# EAGLE design MoteinoM0_mic_v0.4 (EAGLE 9.6.2)
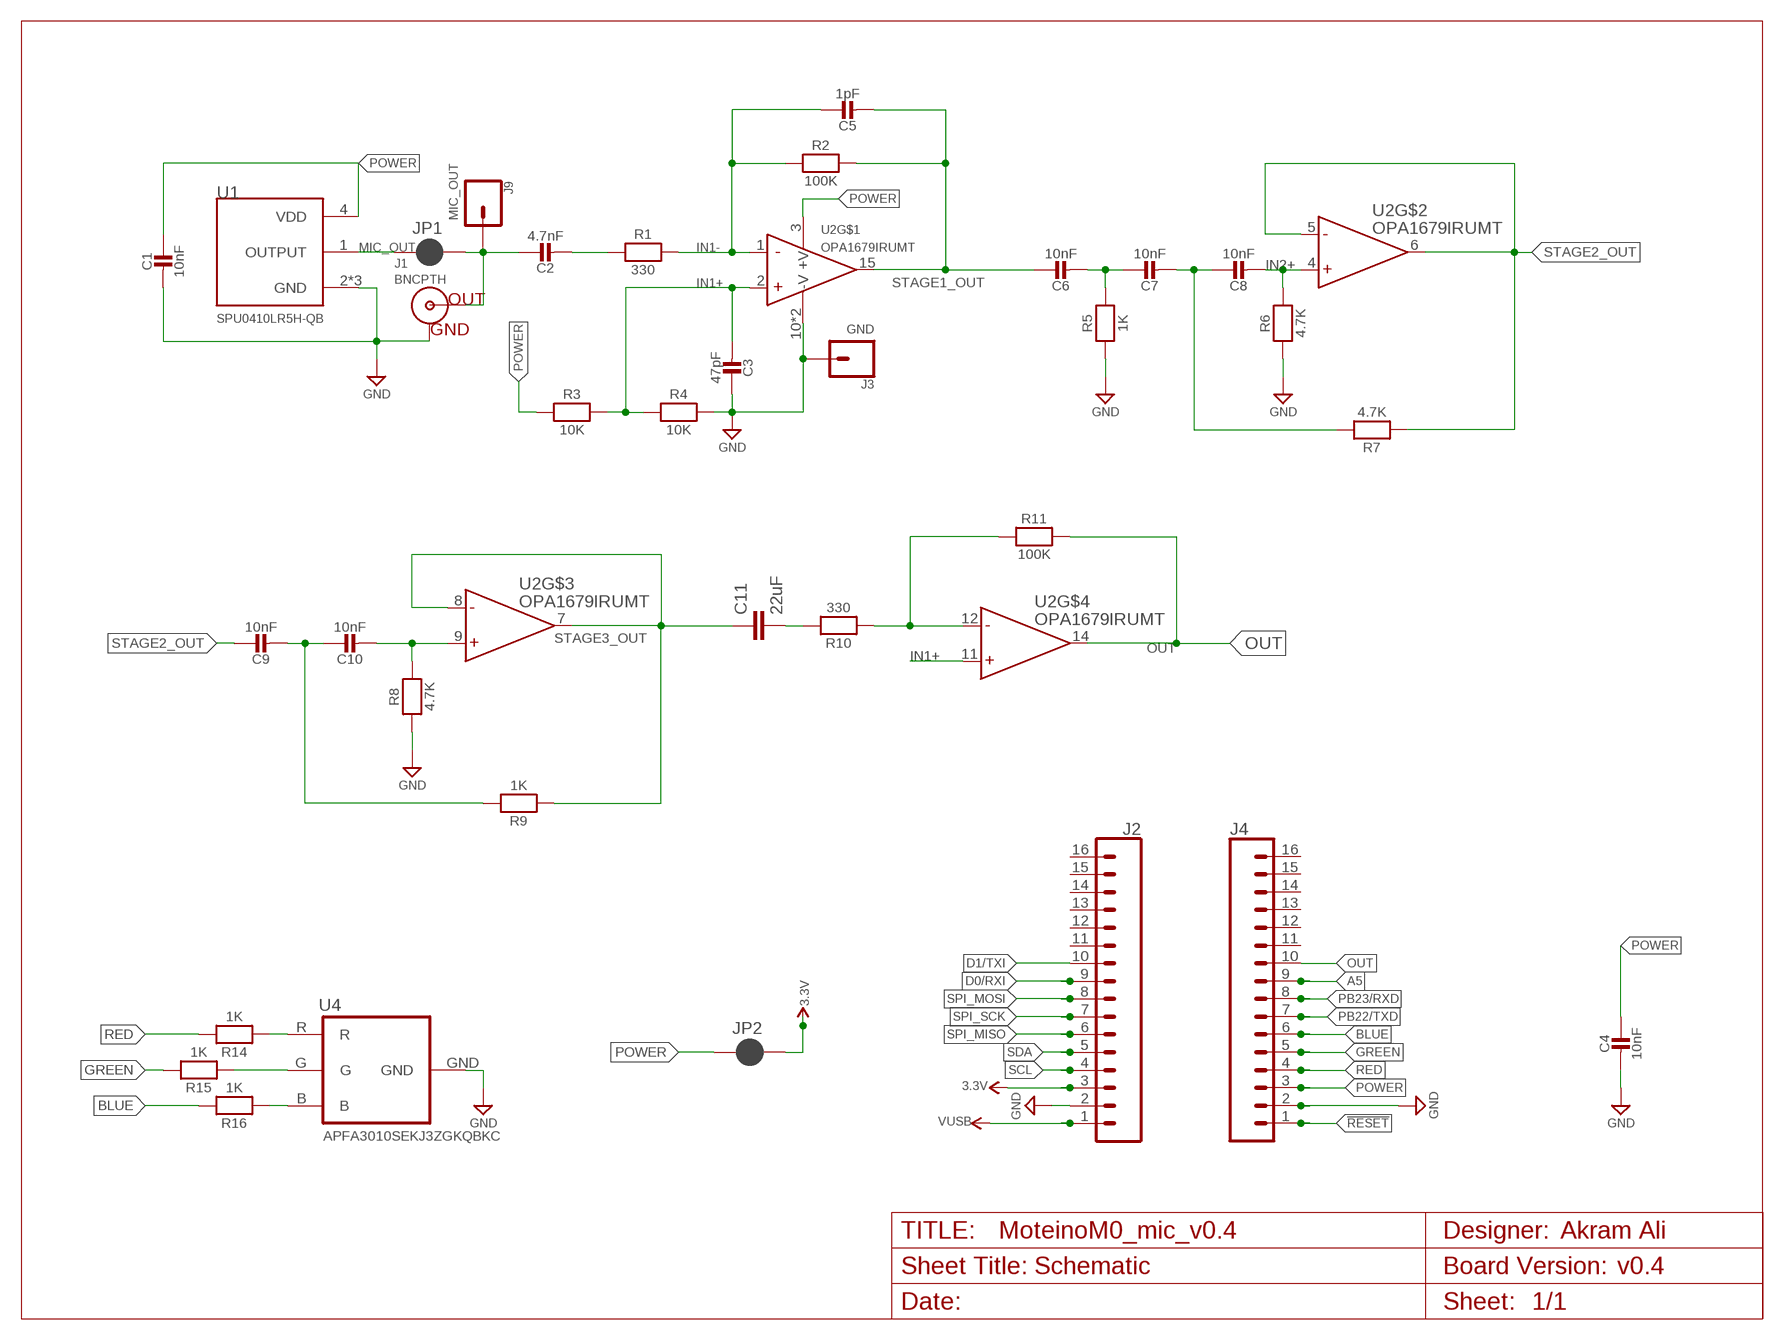
[diagram p0: schematic, sheet 1]

## Parts
C1  10nF  MICROBUILDER_CAP_CERAMIC_0402MP  [MICROBUILDER__0402MP]
C2  4.7nF  MICROBUILDER_CAP_CERAMIC_0402MP  [MICROBUILDER__0402MP]
C3  47pF  MICROBUILDER_CAP_CERAMIC_0402MP  [MICROBUILDER__0402MP]
C4  10nF  MICROBUILDER_CAP_CERAMIC_0402MP  [MICROBUILDER__0402MP]
C5  1pF  MICROBUILDER_CAP_CERAMIC_0402MP  [MICROBUILDER__0402MP]
C6  10nF  MICROBUILDER_CAP_CERAMIC_0402MP  [MICROBUILDER__0402MP]
C7  10nF  MICROBUILDER_CAP_CERAMIC_0402MP  [MICROBUILDER__0402MP]
C8  10nF  MICROBUILDER_CAP_CERAMIC_0402MP  [MICROBUILDER__0402MP]
C9  10nF  MICROBUILDER_CAP_CERAMIC_0402MP  [MICROBUILDER__0402MP]
C10  10nF  MICROBUILDER_CAP_CERAMIC_0402MP  [MICROBUILDER__0402MP]
C11  22uF  CAP0805  [0805]
J1  BNCPTH  [BNC]
J2  CONN_161X16_NO_SILK  [1X16_NO_SILK]
J3  GND  CONN_01  [1X01]
J4  CONN_161X16_NO_SILK  [1X16_NO_SILK]
J9  MIC_OUT  CONN_01  [1X01]
JP1  JUMPER-SMT_2_NC_PASTE_SILK  [SMT-JUMPER_2_NC_PASTE_SILK]
JP2  JUMPER-SMT_2_NC_PASTE_SILK  [SMT-JUMPER_2_NC_PASTE_SILK]
R1  330  MICROBUILDER_RESISTOR_0402MP  [MICROBUILDER__0402MP]
R2  100K  MICROBUILDER_RESISTOR_0402MP  [MICROBUILDER__0402MP]
R3  10K  MICROBUILDER_RESISTOR_0402MP  [MICROBUILDER__0402MP]
R4  10K  MICROBUILDER_RESISTOR_0402MP  [MICROBUILDER__0402MP]
R5  1K  MICROBUILDER_RESISTOR_0402MP  [MICROBUILDER__0402MP]
R6  4.7K  MICROBUILDER_RESISTOR_0402MP  [MICROBUILDER__0402MP]
R7  4.7K  MICROBUILDER_RESISTOR_0402MP  [MICROBUILDER__0402MP]
R8  4.7K  MICROBUILDER_RESISTOR_0402MP  [MICROBUILDER__0402MP]
R9  1K  MICROBUILDER_RESISTOR_0402MP  [MICROBUILDER__0402MP]
R10  330  MICROBUILDER_RESISTOR_0402MP  [MICROBUILDER__0402MP]
R11  100K  MICROBUILDER_RESISTOR_0402MP  [MICROBUILDER__0402MP]
R14  1K  MICROBUILDER_RESISTOR_0402MP  [MICROBUILDER__0402MP]
R15  1K  MICROBUILDER_RESISTOR_0402MP  [MICROBUILDER__0402MP]
R16  1K  MICROBUILDER_RESISTOR_0402MP  [MICROBUILDER__0402MP]
U1  SPU0410LR5H-QB  [XDCR_SPU0410LR5H-QB]
U2  OPA1679IRUMT  [QFN65P400X400X80-17N]
U4  APFA3010SEKJ3ZGKQBKC  [SMD-RA-4]

## Nets
3.3V: J2.3 JP2.2
!RESET: J4.1
A5: J4.9
BLUE: J4.6 R16.2
D0/RXI: J2.9
D1/TXI: J2.10
GND: C1.2 C3.1 C4.2 J1.GND J2.2 J3.1 J4.2 R4.2 R5.1 R6.1 R8.1 U1.2(GND) U1.3(GND) U1.5(GND) U2.10(-V) U2.17(-V) U4.GND
GREEN: J4.5 R15.2
IN1+: C3.2 R3.2 R4.1 U2.2(+IN) U2.11(+IN)
IN1-: C5.1 R1.2 R2.1 U2.1(-IN)
IN2+: C8.2 R6.2 U2.4(+IN)
MIC_OUT: C2.1 J1.S(OUT) J9.1 JP1.2
N$1: C9.2 C10.1 R9.2
N$2: C6.2 C7.1 R5.2
N$3: C7.2 C8.1 R7.2
N$4: C2.2 R1.1
N$6: R14.1 U4.R
N$7: C10.2 R8.2 U2.9(+IN)
N$8: C11.2 R10.2
N$10: R15.1 U4.G
N$11: R10.1 R11.1 U2.12(-IN)
N$15: R16.1 U4.B
N$19: JP1.1 U1.1(OUTPUT)
OUT: J4.10 R11.2 U2.14(OUT)
PB22/TXD: J4.7
PB23/RXD: J4.8
POWER: C1.1 C4.1 J4.3 JP2.1 R3.1 U1.4(VDD) U2.3(+V)
RED: J4.4 R14.2
SCL: J2.4
SDA: J2.5
SPI_MISO: J2.6
SPI_MOSI: J2.8
SPI_SCK: J2.7
STAGE1_OUT: C5.2 C6.1 R2.2 U2.15(OUT)
STAGE2_OUT: C9.1 R7.1 U2.5(-IN) U2.6(OUT)
STAGE3_OUT: C11.1 R9.1 U2.7(OUT) U2.8(-IN)
VUSB: J2.1
Unconnected: J2.11 J2.12 J2.13 J2.14 J2.15 J2.16 J4.11 J4.12 J4.13 J4.14 J4.15 J4.16

## Notes on the sheet
- Akram Ali
- v0.4

## Library data of the parts
C1-C10 = Adafruit Feather 32u4 Bluefruit LE:MICROBUILDER_CAP_CERAMIC: Ceramic Capacitors For new designs, use the packages preceded by an '_' character since they are more reliable: The following footprints should be used on most boards: _0402 - Standard footprint for regular board layouts _0603 - Standard footprint for regular board layouts _0805 - Standard footprint for regular board layouts _1206 - Standard footprint for regular board layouts For extremely tight-pitch boards where space is at a premium, the following 'micro-pitch' footprints can be used (smaller pads, no silkscreen outline, etc.): _0402MP - Micro-pitch footprint for very dense/compact boards _0603MP - Micro-pitch footprint for very dense/compact boards _0805MP - Micro-pitch footprint for very dense/compact boards _1206MP - Micro-pitch footprint for very dense/compact boards; MPN: GRM155R71H104KE14J
C11 = SparkFun-Passives:CAP: Capacitor Standard 0603 ceramic capacitor, and 0.1" leaded capacitor.
J1 = SparkFun-Connectors:BNC: BNC Right Angle Connector Mouser Part# 5227161 SparkFun Products: BNC Connector - Right Angle <https://www.sparkfun.com/products/10550>; PROD_ID: LPA-12729; SF_ID: PRT-10550
J2 J4 = SparkFun-Connectors:CONN_16: Multi connection point. Often used as Generic Header-pin footprint for 0.1 inch spaced/style header connections On any of the 0.1 inch spaced packages, you can populate with these: Break Away Headers - Straight <https://www.sparkfun.com/products/116> (PRT-00116) Break Away Male Headers - Right Angle <https://www.sparkfun.com/products/553> (PRT-00553) Female Headers <https://www.sparkfun.com/products/115> (PRT-00115) Break Away Headers - Machine Pin <https://www.sparkfun.com/products/117> (PRT-00117) Break Away Female Headers - Swiss Machine Pin <https://www.sparkfun.com/products/743> (PRT-00743) For SCREWTERMINALS and SPRING TERMINALS visit here: Screw Terimnals on SparkFun.com <https://www.sparkfun.com/search/results?term=Screw+Terminals> (5mm/3.5mm/2.54mm spacing) This device is also useful as a general connection point to wire up your design to another part of your project. Our various solder wires solder well into these plated through hole pads. Hook-Up Wire - Assortment (Stranded, 22 AWG) <https://www.sparkfun.com/products/11375> (PRT-11375) Hook-Up Wire - Assortment (Solid Core, 22 AWG) <https://www.sparkfun.com/products/11367> (PRT-11367) View the entire wire category on our website here <https://www.sparkfun.com/categories/141> Special notes: Molex polarized connector foot print use with SKU : PRT-08231 with associated crimp pins and housings. 1MM SMD Version SKU: PRT-10208 NOTES ON THE VARIANTS LOCK and LOCK_LONGPADS... This footprint was designed to help hold the alignment of a through-hole component (i.e. 6-pin header) while soldering it into place. You may notice that each hole has been shifted either up or down by 0.005 of an inch from it's more standard position (which is a perfectly straight line). This slight alteration caused the pins (the squares in the middle) to touch the edges of the holes. Because they are alternating, it causes a "brace" to hold the component in place. 0.005 has proven to be the perfect amount of "off-center" position when using our standard breakaway headers. Although looks a little odd when you look at the bare footprint, once you have a header in there, the alteration is very hard to notice. Also,if you push a header all the way into place, it is covered up entirely on the bottom side.
J3 J9 = SparkFun-Connectors:CONN_01: Single connection point. Often used as Generic Header-pin footprint for 0.1 inch spaced/style header connections On any of the 0.1 inch spaced packages, you can populate with these: Break Away Headers - Straight <https://www.sparkfun.com/products/116> (PRT-00116) Break Away Male Headers - Right Angle <https://www.sparkfun.com/products/553> (PRT-00553) Female Headers <https://www.sparkfun.com/products/115> (PRT-00115) Break Away Headers - Machine Pin <https://www.sparkfun.com/products/117> (PRT-00117) Break Away Female Headers - Swiss Machine Pin <https://www.sparkfun.com/products/743> (PRT-00743) This device is also useful as a general connection point to wire up your design to another part of your project. Our various solder wires solder well into these plated through hole pads. Hook-Up Wire - Assortment (Stranded, 22 AWG) <https://www.sparkfun.com/products/11375> (PRT-11375) Hook-Up Wire - Assortment (Solid Core, 22 AWG) <https://www.sparkfun.com/products/11367> (PRT-11367) View the entire wire category on our website here <https://www.sparkfun.com/categories/141> Special notes: SMTSO-256-ET is a "flush mount" nut for a 4-40 screw. We mostly use this on specialty testbeds; it is a nice way to connect hardware to your PCB at an adjustable hieght. Also note, the SNAP packages are for using a snappable style connector. We sell a baggie of snaps and they are also used on two LilyPad designs: Snap Assortment - 30 pack (male and female) <https://www.sparkfun.com/products/11347> (DEV-11347) LilyPad Arduino SimpleSnap <https://www.sparkfun.com/products/10941> (DEV-10941) LilyPad SimpleSnap Protoboard <https://www.sparkfun.com/products/10940> (DEV-10940)
JP1 JP2 = SparkFun-Jumpers:JUMPER-SMT_2_NC_PASTE: Normally closed solder jumper This jumper has an aperture in the stencil to allow solder paste to bridge the split in the wire so it's normally closed (NC). Wick off the solder to open the connection. Reapply solder to reclose the connection.
R1-R11 R14-R16 = Adafruit Feather 32u4 Bluefruit LE:MICROBUILDER_RESISTOR: Resistors For new designs, use the packages preceded by an '_' character since they are more reliable: The following footprints should be used on most boards: _0402 - Standard footprint for regular board layouts _0603 - Standard footprint for regular board layouts _0805 - Standard footprint for regular board layouts _1206 - Standard footprint for regular board layouts For extremely tight-pitch boards where space is at a premium, the following 'micro-pitch' footprints can be used (smaller pads, no silkscreen outline, etc.): _0402MP - Micro-pitch footprint for very dense/compact boards _0603MP - Micro-pitch footprint for very dense/compact boards _0805MP - Micro-pitch footprint for very dense/compact boards _1206MP - Micro-pitch footprint for very dense/compact boards; MPN: RC0402FR-074K7P
U1 = SPU0410LR5H-QB:SPU0410LR5H-QB: 100Hz ~ 80kHz Analog Microphone MEMS (Silicon) 1.5V ~ 3.6V Omnidirectional (-38dB ±3dB @ 94dB SPL), SMD Check availability <https://pricing.snapeda.com/parts/SPU0410LR5H-QB/Knowles/view-part?ref=eda>; AVAILABILITY: In Stock; DESCRIPTION: 100 Hz ~ 80 kHz Analog Microphone MEMS (Silicon) 1.5 V ~ 3.6 V Omnidirectional (-38dB ±3dB @ 94dB SPL) Solder Pads; MF: Knowles; MP: SPU0410LR5H-QB; PACKAGE: None; PRICE: None; PURCHASE-URL: https://pricing.snapeda.com/search/part/SPU0410LR5H-QB/?ref=eda
U2 = OPA1679IRUMT:OPA1679IRUMT
U4 = APFA3010SEKJ3ZGKQBKC:APFA3010SEKJ3ZGKQBKC: Designed by AKstudios github.com/akstudios

## Net classes
1 power: width 0.381 mm, clearance 0.254 mm

## Board
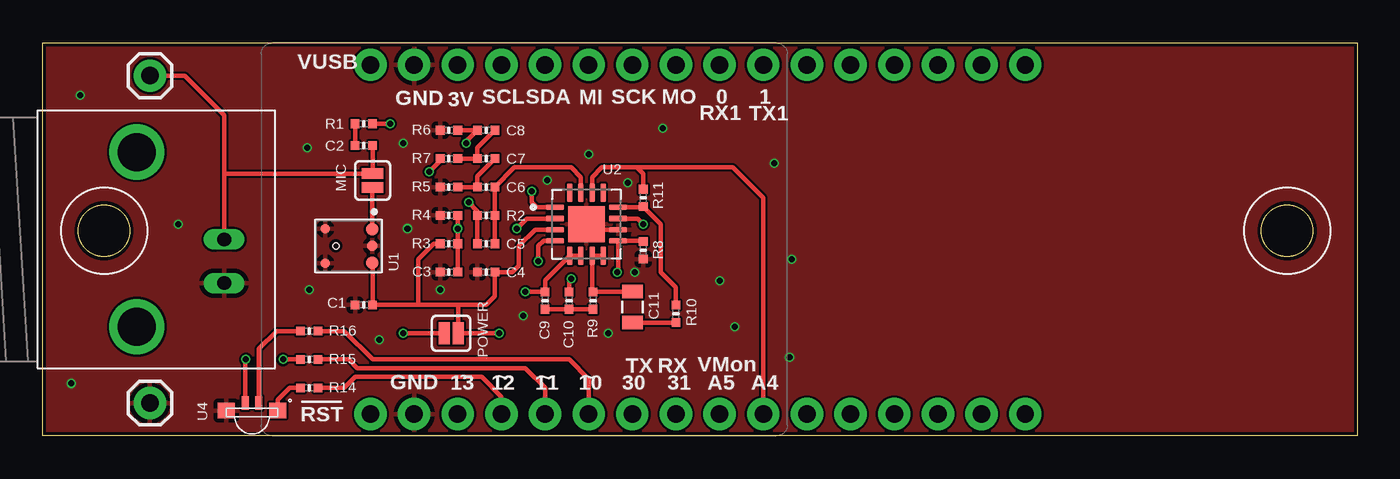
[diagram p1: board, top side]
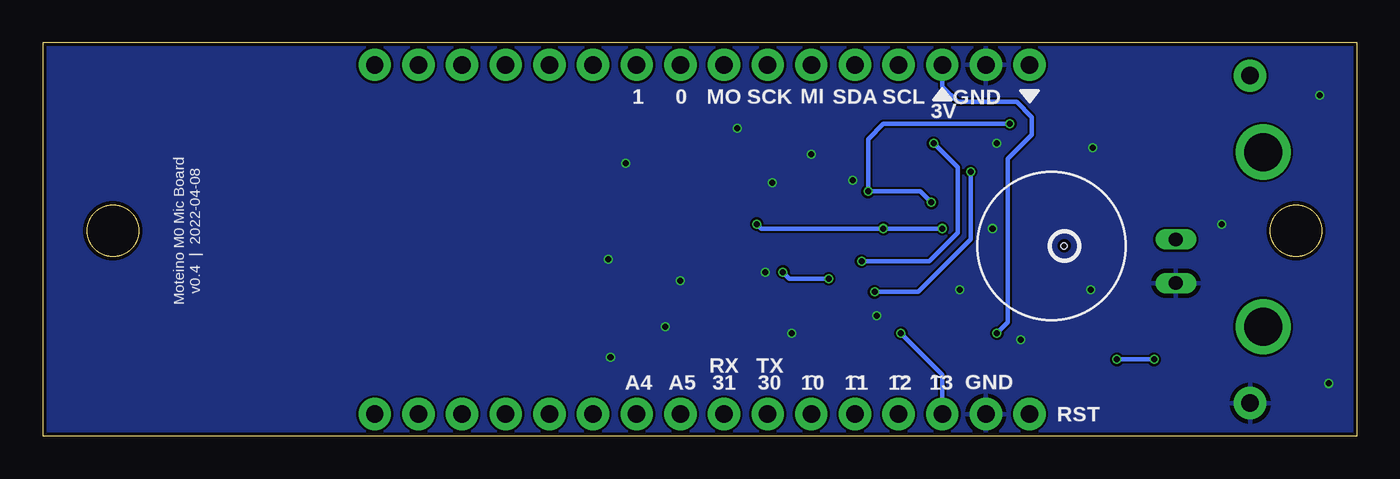
[diagram p2: board, bottom side, seen from below]

Size 76.45 x 22.86 mm. Coordinates in mm from the lower left corner, seen from the top.
Outline: 0,0 0,22.86 76.45,22.86 76.45,0 0,0
Outline: circle at 72.39,11.94 radius 1.5
Outline: circle at 3.56,11.94 radius 1.5
Copper layers (1*16): Top 0.035559375mm / dielectric 1.6mm / Bottom 0.035559375mm
Design rules "jlcpcb2layer *": minimum track width 5mil, minimum drill 12mil, track to track 5mil, track to pad 5mil, pad to pad 5mil, via to via 5mil, smd to smd 5mil, copper to edge 8mil, drill to drill 6mil, minimum pad ring 5mil, minimum via ring 3mil, stop-mask expansion 2.5mil, vias tented up to drill 14mil, thermal gap 10mil

### Footprints (pad centres in the part's own frame; a part is rotated, then mirrored left to right if it is on the bottom)
MICROBUILDER__0402MP = smd 0.5 x 0.5: 1 -0.508,0; 2 0.508,0
0805 = smd 0.8 x 1.2: 1 -0.9,0; 2 0.9,0
BNC = drill 2.2: 3 -5.08,5.08; 4 5.08,5.08 | drill 0.8 long: GND -2.54,0; S 0,0
1X16_NO_SILK = drill 1.016 pad 1.88: 1 0,0; 2 2.54,0; 3 5.08,0; 4 7.62,0; 5 10.16,0; 6 12.7,0; 7 15.24,0; 8 17.78,0; 9 20.32,0; 10 22.86,0; 11 25.4,0; 12 27.94,0; 13 30.48,0; 14 33.02,0; 15 35.56,0; 16 38.1,0
1X01 = drill 1.016 pad 1.88: 1 0,0
SMT-JUMPER_2_NC_PASTE_SILK = smd 0.635 x 1.27: 1 -0.406,0; 2 0.406,0
XDCR_SPU0410LR5H-QB = smd 0.723 x 0.723: 1 -0.966,1.369; 4 0.966,1.369 | smd 0.562 x 0.562: 2 -1.015,-1.369; 3 1.015,-1.369 | smd 0.612 x 0.612: 5 0,1.369 | hole 0.35: 0,-0.735
QFN65P400X400X80-17N = smd 1.06 x 0.32: 1 -1.835,0.975; 2 -1.835,0.325; 3 -1.835,-0.325; 4 -1.835,-0.975; 9 1.835,-0.975; 10 1.835,-0.325; 11 1.835,0.325; 12 1.835,0.975 | smd 0.32 x 1.06: 5 -0.975,-1.835; 6 -0.325,-1.835; 7 0.325,-1.835; 8 0.975,-1.835; 13 0.975,1.835; 14 0.325,1.835; 15 -0.325,1.835; 16 -0.975,1.835 | smd 2.1 x 2.1: 17 0,0
SMD-RA-4 = smd 0.4 x 0.8: B 2.4,0.9; G 1.6,0.9 | smd 1 x 0.9: GND 0.5,0.45; R 3.5,0.45

### Placement (x,y rotation side)
C1  18.67,7.62 180 top
C2  18.67,16.89 180 top
C3  23.62,9.53 0 top
C4  25.78,9.53 180 top
C5  25.78,11.18 0 top
C6  25.78,14.48 180 top
C7  25.78,16.13 180 top
C8  25.78,17.78 180 top
C9  29.21,7.87 270 top
C10  30.61,7.87 90 top
C11  34.29,7.49 270 top
J1  10.54,11.43 90 top
J2  19.05,21.59 0 top
J3  6.22,1.9 0 top
J4  19.05,1.27 0 top
J9  6.22,20.95 0 top
JP1  19.18,14.86 90 top
JP2  23.75,5.97 180 top
R1  18.67,18.16 0 top
R2  25.78,12.83 0 top
R3  23.62,11.18 0 top
R4  23.62,12.83 180 top
R5  23.62,14.48 0 top
R6  23.62,17.78 0 top
R7  23.62,16.13 0 top
R8  34.92,10.79 90 top
R9  32,7.87 270 top
R10  36.83,7.11 270 top
R11  34.92,13.84 90 top
R14  15.49,2.79 0 top
R15  15.49,4.45 0 top
R16  15.49,6.1 0 top
U1  17.78,11.05 270 top
U2  31.62,12.32 0 top
U4  10.16,1.02 0 top

### Tracks (layer width: path | path; a pad name or v marks a point on that pad's centre or on a via)
3.3V  (via drill 0.35)
  Top 0.254: JP2.2 v20.95,5.97
  Bottom 0.254: v20.95,5.97 20.32,6.6 20.32,16.13 18.92,17.53 18.92,18.54 19.81,19.43 23.24,19.43 24.13,20.32 J2.3
BLUE
  Top 0.254: R16.2 17.53,6.1 19.18,4.45 30.61,4.45 31.75,3.3 J4.6
GND  (via drill 0.35)
  Top 0.254: U2.10 31.95,11.99 U2.17
  other vias: 43.56,10.29 40.26,6.35 34.42,9.53 27.94,6.98 31.75,16.38 29.34,14.86 34.04,14.73 36.07,17.91 23.11,8.51 21.21,12.06 20.95,17.02 15.37,16.76 15.49,8.51 19.56,5.59 1.65,3.05 2.16,19.81 7.87,12.32 42.55,15.88 32.89,5.97 39.37,9.02 43.43,4.57
  pour Bottom: 0.13,22.73 0.13,0.11 76.33,-0.09 76.33,22.73
  pour Top: -0.13,22.99 -0.13,-0.15 76.58,-0.34 76.58,22.99
GREEN
  Top 0.254: R15.2 17.78,4.45 18.29,3.94 28.07,3.94 29.21,2.79 J4.5
IN1+  (via drill 0.35)
  Top 0.254: U2.2 28.14,12.64 v27.56,12.06 | R4.1 v24.13,12.06 R3.2 C3.2 | v34.92,12.32 34.6,12.64 U2.11
  Bottom 0.254: v24.13,12.06 v27.56,12.06 34.67,12.06 v34.92,12.32
IN1-  (via drill 0.35)
  Top 0.254: R1.2 v20.19,18.16 | U2.1 28.74,13.29 28.45,13.59 v28.45,14.22 | C5.1 R2.1 25.27,13.08 v24.77,13.59
  Bottom 0.254: v24.77,13.59 25.4,14.22 v28.45,14.22 28.45,17.27 27.56,18.16 v20.19,18.16
IN2+  (via drill 0.35)
  Top 0.254: U2.4 29.12,11.34 28.83,11.05 v28.83,10.16 | R6.2 C8.2 24.64,17.14 v24.64,17.02
  Bottom 0.254: v24.64,17.02 23.24,15.62 23.24,11.81 24.89,10.16 v28.83,10.16
MIC_OUT
  Top 0.254: C2.1 JP1.2 10.57,15.27 10.54,15.24 | J9.1 8.25,20.95 10.54,18.67 10.54,15.24 | 10.54,15.24 J1.S
N$1
  Top 0.254: C9.2 C10.1 R9.2
N$2
  Top 0.254: C7.1 25.27,15.11 C6.2 R5.2
N$3
  Top 0.254: R7.2 C7.2 25.27,16.76 C8.1
N$4
  Top 0.254: C2.2 R1.1
N$6
  Top 0.254: R14.1 14.35,2.79 13.66,2.1 U4.R
N$7  (via drill 0.35)
  Top 0.254: R8.2 34.88,11.34 U2.9 33.46,9.58 v33.4,9.53 | C10.2 30.61,9.02 v30.73,9.14
  Bottom 0.254: v30.73,9.14 33.02,9.14 v33.4,9.53
N$8
  Top 0.254: C11.2 36.82,6.59 R10.2
N$10  (via drill 0.35)
  Top 0.254: R15.1 v13.97,4.45 | v11.81,4.45 11.76,4.39 U4.G
  Bottom 0.254: v13.97,4.45 v11.81,4.45
N$11
  Top 0.254: R10.1 36.83,8.64 35.94,9.53 35.94,12.32 R11.1 34.88,13.29 U2.12
N$15
  Top 0.254: U4.B 12.56,5.07 13.59,6.1 R16.1
N$19
  Top 0.254: U1.1 19.15,14.42 JP1.1
OUT
  Top 0.254: U2.14 31.95,15.06 32.51,15.62 34.54,15.62 | 34.54,15.62 34.92,15.24 R11.2 | 34.54,15.62 40.13,15.62 41.91,13.84 J4.10
POWER  (via drill 0.35)
  Top 0.254: U1.4 19.18,10.05 C1.1 21.84,7.62 | 21.84,7.62 24.13,7.62 | 24.13,7.62 25.78,7.62 26.29,8.13 C4.1 27.3,9.53 27.69,9.91 27.69,11.05 28.63,11.99 U2.3 | R3.1 22.73,11.18 21.84,10.29 21.84,7.62 | 24.13,7.62 24.16,7.59 JP2.1 v26.54,5.97
  Bottom 0.254: v26.54,5.97 24.13,3.56 J4.3
RED
  Top 0.254: R14.2 17.53,2.79 18.16,3.43 25.53,3.43 26.67,2.29 J4.4
STAGE1_OUT
  Top 0.254: C5.2 R2.2 C6.1 27.43,15.62 30.73,15.62 31.3,15.06 U2.15
STAGE2_OUT  (via drill 0.35)
  Top 0.254: R7.1 23.11,16 v22.48,15.37 | v28.07,8.38 C9.1 29.21,9.05 U2.5 U2.6
  Bottom 0.254: v22.48,15.37 22.48,11.43 25.53,8.38 v28.07,8.38
STAGE3_OUT
  Top 0.254: U2.8 U2.7 31.95,8.44 R9.1 34.28,8.38 C11.1

### Text on the board
tPlace: VUSB | GND | 3V | SCL | SDA | MI | SCK | MO | 0 | 1 | RX1 | TX1 | ~ | ~ | ~ | ~ | TX | RX | VMon | GND | 13 | 12 | 11 | 10 | 30 | 31 | A5 | A4 | RST
bPlace: GND | SCL | SDA | MI | SCK | MO | 0 | 1 | 3V | Moteino M0 Mic Board / v0.4 | 2022-04-08 | TX | RX | GND | 13 | ~ | ~ | 12 | ~ | 11 | ~ | 10 | 30 | 31 | A5 | A4 | RST
tNames: MIC | POWER